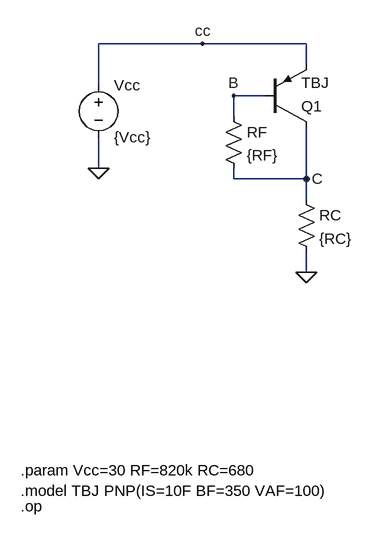
[diagram p0: schematic TBJPNP04CAop.asc]
TBJPNP04CAop.asc, the LTspice schematic file:
Version 4
SHEET 1 1608 1076
WIRE 128 -16 -32 -16
WIRE 288 -16 128 -16
WIRE 288 16 288 -16
WIRE -32 48 -32 -16
WIRE 224 64 176 64
WIRE 176 96 176 64
WIRE -32 176 -32 128
WIRE 176 192 176 176
WIRE 288 192 288 112
WIRE 288 192 176 192
WIRE 288 224 288 192
WIRE 288 336 288 304
FLAG -32 176 0
FLAG 288 336 0
FLAG 128 -16 cc
FLAG 176 64 B
FLAG 288 192 C
SYMBOL res 160 80 R0
SYMATTR InstName RF
SYMATTR Value {RF}
SYMBOL res 272 208 R0
SYMATTR InstName RC
SYMATTR Value {RC}
SYMBOL voltage -32 32 R0
WINDOW 123 0 0 Left 0
WINDOW 39 0 0 Left 0
SYMATTR InstName Vcc
SYMATTR Value {Vcc}
SYMBOL pnp 224 112 M180
SYMATTR InstName Q1
SYMATTR Value TBJ
TEXT -152 640 Left 2 !.param Vcc=30 RF=820k RC=680
TEXT -152 696 Left 2 !.op
TEXT -152 672 Left 2 !.model TBJ PNP(IS=10F BF=350 VAF=100)

The netlist it stands for:
* TBJPNP04CAop.asc
RF B C {RF}
RC C 0 {RC}
Vcc cc 0 {Vcc}
Q1 C B cc 0 TBJ
.model NPN NPN
.model PNP PNP
.lib standard.bjt
.param Vcc=30 RF=820k RC=680
.op
.model TBJ PNP(IS=10F BF=350 VAF=100)
.backanno
.end